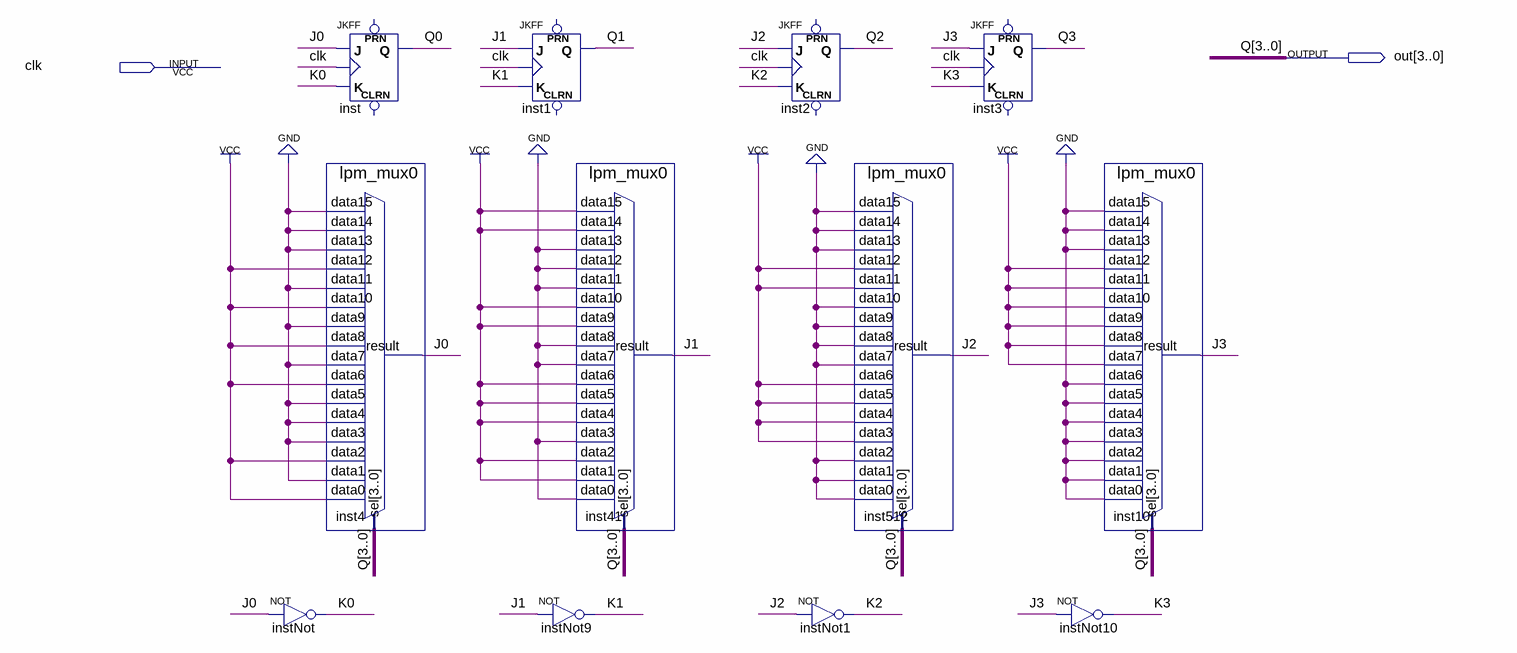
[diagram p0: schematic sheet]
// Quartus schematic lab7_3.bdf as structural Verilog: 12 symbols, 2 pins
module lab7_3 (
  input  clk,
  output [3:0] out
);

  wire J0, J1, J2, J3, K0, K1, K2, K3;

  not instNot (K0, J0);
  JKFF inst (.K(K0), .J(J0), .CLK(clk), .Q(out[0]));  // open: PRN, CLRN
  lpm_mux0 inst4 (
    .data15(1'b0), .data14(1'b0), .data13(1'b0), .data12(1'b1), .data11(1'b0), .data10(1'b1), .data9(1'b0),
    .data8(1'b1), .data7(1'b0), .data6(1'b1), .data5(1'b0), .data4(1'b0), .data3(1'b0), .data2(1'b1),
    .data1(1'b0), .data0(1'b1), .sel(out), .result(J0));
  JKFF inst1 (.K(K1), .J(J1), .CLK(clk), .Q(out[1]));  // open: PRN, CLRN
  lpm_mux0 inst41 (
    .data15(1'b1), .data14(1'b1), .data13(1'b0), .data12(1'b0), .data11(1'b0), .data10(1'b1), .data9(1'b1),
    .data8(1'b0), .data7(1'b0), .data6(1'b1), .data5(1'b1), .data4(1'b1), .data3(1'b0), .data2(1'b1),
    .data1(1'b1), .data0(1'b0), .sel(out), .result(J1));
  not instNot9 (K1, J1);
  JKFF inst2 (.K(K2), .J(J2), .CLK(clk), .Q(out[2]));  // open: PRN, CLRN
  not instNot1 (K2, J2);
  lpm_mux0 inst512 (
    .data15(1'b0), .data14(1'b0), .data13(1'b0), .data12(1'b1), .data11(1'b1), .data10(1'b0), .data9(1'b0),
    .data8(1'b0), .data7(1'b0), .data6(1'b1), .data5(1'b1), .data4(1'b1), .data3(1'b1), .data2(1'b0),
    .data1(1'b0), .data0(1'b0), .sel(out), .result(J2));
  JKFF inst3 (.K(K3), .J(J3), .CLK(clk), .Q(out[3]));  // open: PRN, CLRN
  not instNot10 (K3, J3);
  lpm_mux0 inst10 (
    .data15(1'b0), .data14(1'b0), .data13(1'b0), .data12(1'b1), .data11(1'b1), .data10(1'b1), .data9(1'b1),
    .data8(1'b1), .data7(1'b1), .data6(1'b0), .data5(1'b0), .data4(1'b0), .data3(1'b0), .data2(1'b0),
    .data1(1'b0), .data0(1'b0), .sel(out), .result(J3));

  // Other names for the same wires on the sheet: Q[3:0] = out; Q0 = out[0]; Q1 = out[1]; Q2 = out[2]; Q3 = out[3]
endmodule
